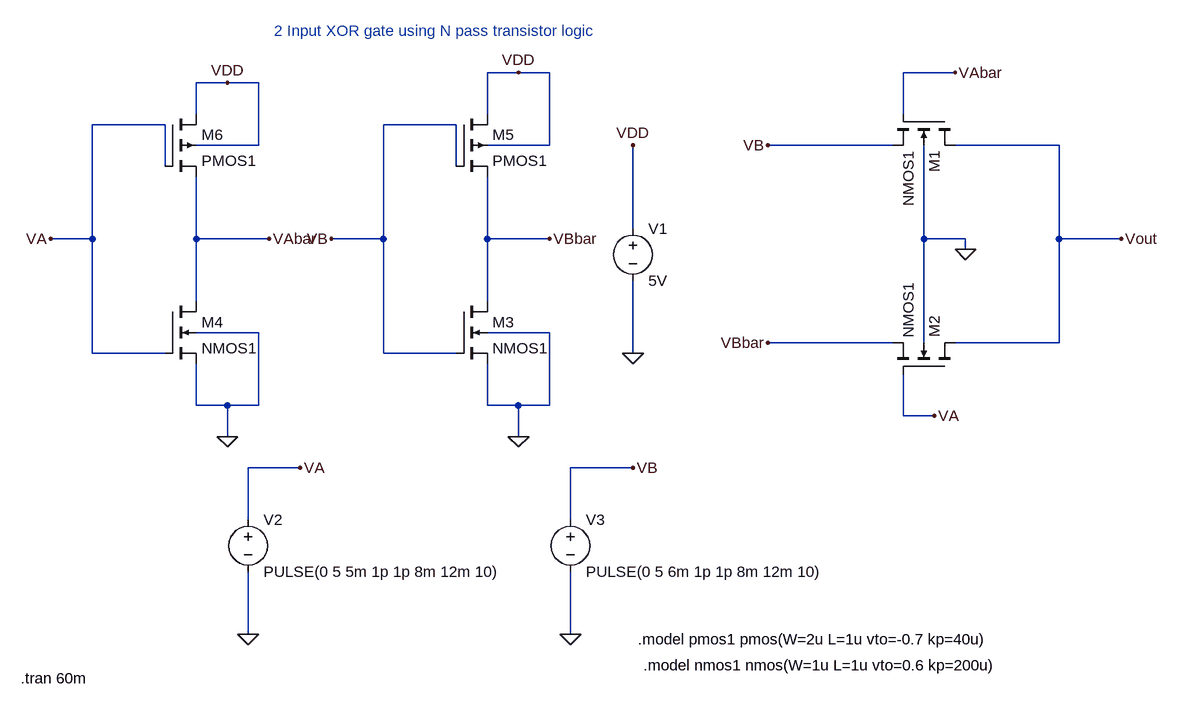
[diagram p0: schematic 2xor ptl.asc]
2xor ptl.asc, the LTspice schematic file:
Version 4
SHEET 1 1432 804
WIRE 432 -144 384 -144
WIRE 480 -144 432 -144
WIRE 1104 -144 1024 -144
WIRE -16 -128 -64 -128
WIRE 32 -128 -16 -128
WIRE -64 -80 -64 -128
WIRE 384 -80 384 -144
WIRE 1024 -80 1024 -144
WIRE -112 -64 -224 -64
WIRE 336 -64 224 -64
WIRE 32 -32 32 -128
WIRE 32 -32 -64 -32
WIRE 480 -32 480 -144
WIRE 480 -32 384 -32
WIRE 1008 -32 816 -32
WIRE 1264 -32 1104 -32
WIRE -112 0 -112 -64
WIRE 336 0 336 -64
WIRE 608 96 608 -32
WIRE -224 112 -224 -64
WIRE -224 112 -288 112
WIRE -64 112 -64 16
WIRE 48 112 -64 112
WIRE 224 112 224 -64
WIRE 224 112 144 112
WIRE 384 112 384 16
WIRE 480 112 384 112
WIRE 1056 112 1056 -32
WIRE 1120 112 1056 112
WIRE 1264 112 1264 -32
WIRE 1360 112 1264 112
WIRE 1120 128 1120 112
WIRE -64 208 -64 112
WIRE 384 208 384 112
WIRE 32 256 -64 256
WIRE 480 256 384 256
WIRE 1008 272 816 272
WIRE 1056 272 1056 112
WIRE 1264 272 1264 112
WIRE 1264 272 1104 272
WIRE -224 288 -224 112
WIRE -112 288 -224 288
WIRE 224 288 224 112
WIRE 336 288 224 288
WIRE 608 288 608 176
WIRE -64 368 -64 304
WIRE -16 368 -64 368
WIRE 32 368 32 256
WIRE 32 368 -16 368
WIRE 384 368 384 304
WIRE 432 368 384 368
WIRE 480 368 480 256
WIRE 480 368 432 368
WIRE 1024 384 1024 320
WIRE 1072 384 1024 384
WIRE -16 416 -16 368
WIRE 432 416 432 368
WIRE 96 464 16 464
WIRE 608 464 512 464
WIRE 16 544 16 464
WIRE 512 544 512 464
WIRE 16 720 16 624
WIRE 512 720 512 624
FLAG -16 416 0
FLAG 16 720 0
FLAG 512 720 0
FLAG 432 416 0
FLAG 608 288 0
FLAG 432 -144 VDD
FLAG -16 -128 VDD
FLAG 608 -32 VDD
FLAG 816 -32 VB
FLAG 608 464 VB
FLAG 144 112 VB
FLAG -288 112 VA
FLAG 96 464 VA
FLAG 1072 384 VA
FLAG 1104 -144 VAbar
FLAG 480 112 VBbar
FLAG 816 272 VBbar
FLAG 48 112 VAbar
FLAG 1360 112 Vout
FLAG 1120 128 0
SYMBOL pmos4 -112 -80 R0
SYMATTR InstName M6
SYMATTR Value PMOS1
SYMBOL pmos4 336 -80 R0
SYMATTR InstName M5
SYMATTR Value PMOS1
SYMBOL nmos4 -112 208 R0
SYMATTR InstName M4
SYMATTR Value NMOS1
SYMBOL nmos4 336 208 R0
SYMATTR InstName M3
SYMATTR Value NMOS1
SYMBOL nmos4 1104 -80 R90
SYMATTR InstName M1
SYMATTR Value NMOS1
SYMBOL nmos4 1104 320 M270
SYMATTR InstName M2
SYMATTR Value NMOS1
SYMBOL voltage 608 80 R0
SYMATTR InstName V1
SYMATTR Value 5V
SYMBOL voltage 16 528 R0
WINDOW 123 0 0 Left 0
WINDOW 39 0 0 Left 0
SYMATTR InstName V2
SYMATTR Value PULSE(0 5 5m 1p 1p 8m 12m 10)
SYMBOL voltage 512 528 R0
WINDOW 123 0 0 Left 0
WINDOW 39 0 0 Left 0
SYMATTR InstName V3
SYMATTR Value PULSE(0 5 6m 1p 1p 8m 12m 10)
TEXT 56 -208 Left 2 ;2 Input XOR gate using N pass transistor logic
TEXT 616 728 Left 2 !.model pmos1 pmos(W=2u L=1u vto=-0.7 kp=40u)
TEXT 624 768 Left 2 !.model nmos1 nmos(W=1u L=1u vto=0.6 kp=200u)
TEXT -334 788 Left 2 !.tran 60m

The netlist it stands for:
* 2xor ptl.asc
M6 VDD VA VAbar VDD PMOS1
M5 VDD VB VBbar VDD PMOS1
M4 VAbar VA 0 0 NMOS1
M3 VBbar VB 0 0 NMOS1
M1 Vout VAbar VB 0 NMOS1
M2 Vout VA VBbar 0 NMOS1
V1 VDD 0 5V
V2 VA 0 PULSE(0 5 5m 1p 1p 8m 12m 10)
V3 VB 0 PULSE(0 5 6m 1p 1p 8m 12m 10)
.model NMOS NMOS
.model PMOS PMOS
.lib standard.mos
* 2 Input XOR gate using N pass transistor logic
.model pmos1 pmos(W=2u L=1u vto=-0.7 kp=40u)
.model nmos1 nmos(W=1u L=1u vto=0.6 kp=200u)
.tran 60m
.backanno
.end